# EAGLE schematic PowerSupplyFromArduino (EAGLE 6.1)
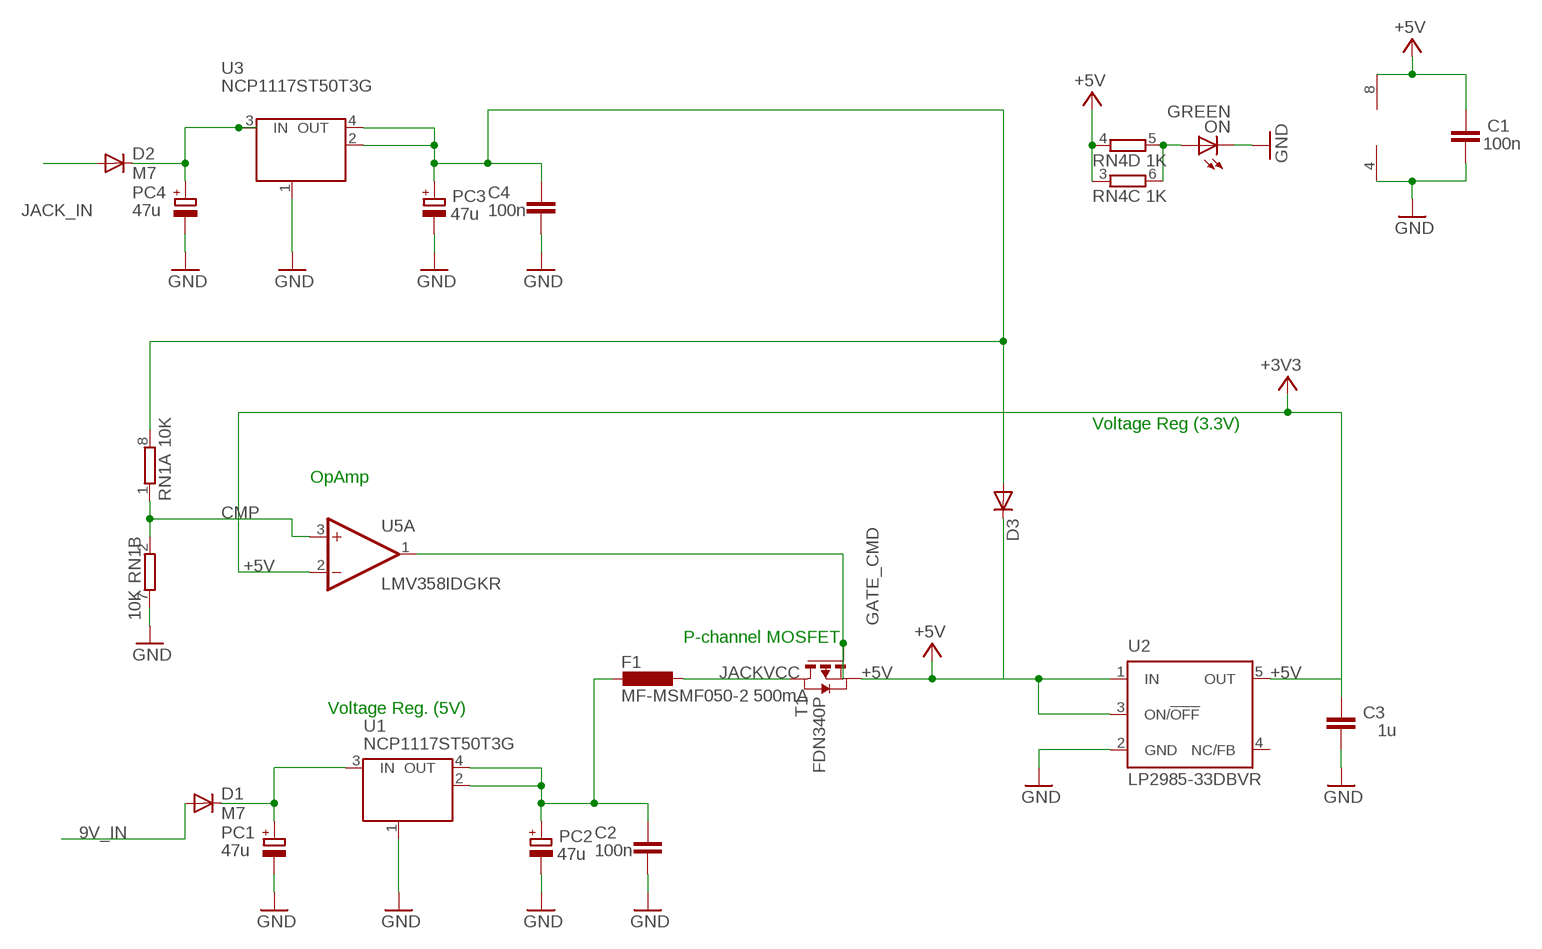
[diagram p0: schematic, sheet 1]

## Parts
C1  100n  C-EU0603-RND  [C0603-ROUND]
C2  100n  C-EU0603-RND  [C0603-ROUND]
C3  1u  C-EU0603-RND  [C0603-ROUND]
C4  100n  C-EU0603-RND  [C0603-ROUND]
D1  M7  DIODE-SMB  [SMB]
D2  M7  DIODE-SMB  [SMB]
D3  1N4004  [DO41-10]
F1  MF-MSMF050-2 500mA  L-EUL1812  [L1812]
ON  GREEN  LEDCHIP-LED0805  [CHIP-LED0805]
PC1  47u  CPOL-EUD  [PANASONIC_D]
PC2  47u  CPOL-EUD  [PANASONIC_D]
PC3  47u  CPOL-EUD  [PANASONIC_D]
PC4  47u  CPOL-EUD  [PANASONIC_D]
RN1  10K  4R-NCAY16  [CAY16]
RN4  1K  4R-NCAY16  [CAY16]
T1  FDN340P  PMOSSOT23  [SOT-23]
U1  NCP1117ST50T3G  MC33269ST-3.3T3  [SOT223]
U2  LP2985-33DBVR  LP2985-XXDBVR33  [SOT23-DBV]
U3  NCP1117ST50T3G  MC33269ST-3.3T3  [SOT223]
U5  LMV358IDGKR  LMV358MMX  [MSOP08]

## Nets
9V_IN [power]: D1.A
+5V [usbvcc]: C1.2 C3.2 D3.C RN4.3 RN4.4 T1.2(S) U2.1(IN) U2.3(ON/!OFF) U2.5(OUT) U5.2(A:-IN) U5.8(P:V+) ; supply symbol labelled +3V3
CMP: RN1.1 RN1.2 U5.3(A:+IN)
GATE_CMD: T1.3(G) U5.1(A:OUT)
GND [gnd]: C1.1 C2.1 C3.1 C4.1 ON.C PC1.- PC2.- PC3.- PC4.- RN1.7 U1.1(GND/ADJ) U2.2(GND) U3.1(GND/ADJ) U5.4(P:V-)
JACK_IN [power]: D2.A
JACKVCC [usbvcc]: C2.2 F1.1 F1.2 PC2.+ T1.1(D) U1.2(OUT) U1.4(OUT)
N$1 [power]: D1.C PC1.+ U1.3(IN)
N$2 [power]: D2.C PC4.+ U3.3(IN)
N$3: ON.A RN4.5 RN4.6
N$4 [usbvcc]: C4.2 D3.A PC3.+ RN1.8 U3.2(OUT) U3.4(OUT)
Unconnected: RN1.3 RN1.4 RN1.5 RN1.6 RN4.1 RN4.2 RN4.7 RN4.8 U2.4(NC/FB) U5.5(B:+IN) U5.6(B:-IN) U5.7(B:OUT)

## Notes on the sheet
- Voltage Reg (3.3V)
- OpAmp
- P-channel MOSFET
- Voltage Reg. (5V)

## Library data of the parts
C1-C4 = SmartPrj:C-EU: CAPACITOR, European symbol
D1 D2 = diode:DIODE-: DIODE
D3 = diode:1N4004: DIODE general purpose rectifier, 1 A
F1 = rcl:L-EU: INDUCTOR, European symbol
ON = led:LED: LED OSRAM: - CHIPLED LG R971, LG N971, LY N971, LG Q971, LY Q971, LO R971, LY R971 LH N974, LH R974 LS Q976, LO Q976, LY Q976 LO Q996 - Hyper CHIPLED LW Q18S LB Q993, LB Q99A, LB R99A - SideLED LS A670, LO A670, LY A670, LG A670, LP A670 LB A673, LV A673, LT A673, LW A673 LH A674 LY A675 LS A676, LA A676, LO A676, LY A676, LW A676 LS A679, LY A679, LG A679 - Hyper Micro SIDELED® LS Y876, LA Y876, LO Y876, LY Y876 LT Y87S - SmartLED LW L88C, LW L88S LB L89C, LB L89S, LG L890 LS L89K, LO L89K, LY L89K LS L896, LA L896, LO L896, LY L896 - TOPLED LS T670, LO T670, LY T670, LG T670, LP T670 LSG T670, LSP T670, LSY T670, LOP T670, LYG T670 LG T671, LOG T671, LSG T671 LB T673, LV T673, LT T673, LW T673 LH T674 LS T676, LA T676, LO T676, LY T676, LB T676, LH T676, LSB T676, LW T676 LB T67C, LV T67C, LT T67C, LS T67K, LO T67K, LY T67K, LW E67C LS E67B, LA E67B, LO E67B, LY E67B, LB E67C, LV E67C, LT E67C LW T67C LS T679, LY T679, LG T679 LS T770, LO T770, LY T770, LG T770, LP T770 LB T773, LV T773, LT T773, LW T773 LH T774 LS E675, LA E675, LY E675, LS T675 LS T776, LA T776, LO T776, LY T776, LB T776 LHGB T686 LT T68C, LB T68C - Hyper Mini TOPLED® LB M676 - Mini TOPLED Santana® LG M470 LS M47K, LO M47K, LY M47K Source: http://www.osram.convergy.de LUXEON: - LUMILED® LXK2-PW12-R00, LXK2-PW12-S00, LXK2-PW14-U00, LXK2-PW14-V00 LXK2-PM12-R00, LXK2-PM12-S00, LXK2-PM14-U00 LXK2-PE12-Q00, LXK2-PE12-R00, LXK2-PE12-S00, LXK2-PE14-T00, LXK2-PE14-U00 LXK2-PB12-K00, LXK2-PB12-L00, LXK2-PB12-M00, LXK2-PB14-N00, LXK2-PB14-P00, LXK2-PB14-Q00 LXK2-PR12-L00, LXK2-PR12-M00, LXK2-PR14-Q00, LXK2-PR14-R00 LXK2-PD12-Q00, LXK2-PD12-R00, LXK2-PD12-S00 LXK2-PH12-R00, LXK2-PH12-S00 LXK2-PL12-P00, LXK2-PL12-Q00, LXK2-PL12-R00 Source: www.luxeon.com KINGBRIGHT: KA-3528ASYC Source: www.kingbright.com
PC1-PC4 = rcl:CPOL-EU: POLARIZED CAPACITOR, European symbol
RN1 RN4 = resistor-dil:4R-N: Array Chip Resistor Source: RS Component / Phycomp
T1 = zetex:PMOSSOT23: MOS FET
U1 U3 = linear:MC33269ST*: Adjustable Output Low Dropout Voltage Regulator 800 mA Source: http://www.onsemi.com/pub/Collateral/MC33269-D.PDF
U2 = SmartPrj:LP2985-XXDBVR: ULTRALOW-POWER 50-mA LOW-DROPOUT LINEAR REGULATORS 50-mA Low-Dropout Regulator Source: http://focus.ti.com/lit/ds/symlink/tps77001.pdf
U5 = linear:LMV358?*: Dual General Purpose, Low Voltage, Rail-to-Rail Output Operational Amplifiers Source: http://www.national.com/mpf/LM/LMV321.html http://www.national.com/dt/lmv_qual.pdf

## Net classes
0 default: width 0.254 mm, clearance 0.254 mm
1 power: width 0.61 mm, drill 0.61 mm, clearance 0.254 mm
2 gnd: width 0.305 mm, drill 0.559 mm, clearance 0.254 mm
3 usbvcc: width 0.508 mm, drill 0.61 mm, clearance 0.254 mm
4 aref: width 0.406 mm, drill 0.61 mm, clearance 0.254 mm